# Altium project MCU099_LP-MSPM0L1306.PrjPcb (part 2 of 3)

## Sheet MCU099_02_XDS110_Debug_Probe.SchDoc: XDS110-ET Debug Probe
size 431 x 279 mm; Date: Not shown in title block; ApprovedBy: Not shown in title block; CheckedBy: Not shown in title block; Author: Not shown in title block; CompanyName: Not shown in title block; DrawnBy: Johnson He; Engineer: Not shown in title block; Organization: Not shown in title block; Address1: Not shown in title block; Address2: Not shown in title block; Address3: Not shown in title block; Address4: Not shown in title block; DocumentNumber: 1; Revision: Use project parameter SCH_Rev; SheetNumber: 2; SheetTotal: 6; PageSetup: Record=PageOptions|CenterHorizontal=True|CenterVertical=True|PrintScale=1.00|XCorrection=1.00|YCorrection=1.00|PrintKind=0|BorderSize=5000000|LeftOffset=0|BottomOffset=0|Orientation=2|PaperLength=1000|PaperWidth=1000|Scale=100|PaperSource=15|PrintQuality=600|MediaType=1|DitherType=10|PaperKind=Letter|PrintScaleMode=1; CurrentTime: Not shown in title block; CurrentDate: Not shown in title block; Time: Not shown in title block; DocumentFullPathAndName: Not shown in title block; DocumentName: Not shown in title block; ModifiedDate: Not shown in title block; ImagePath: Not shown in title block
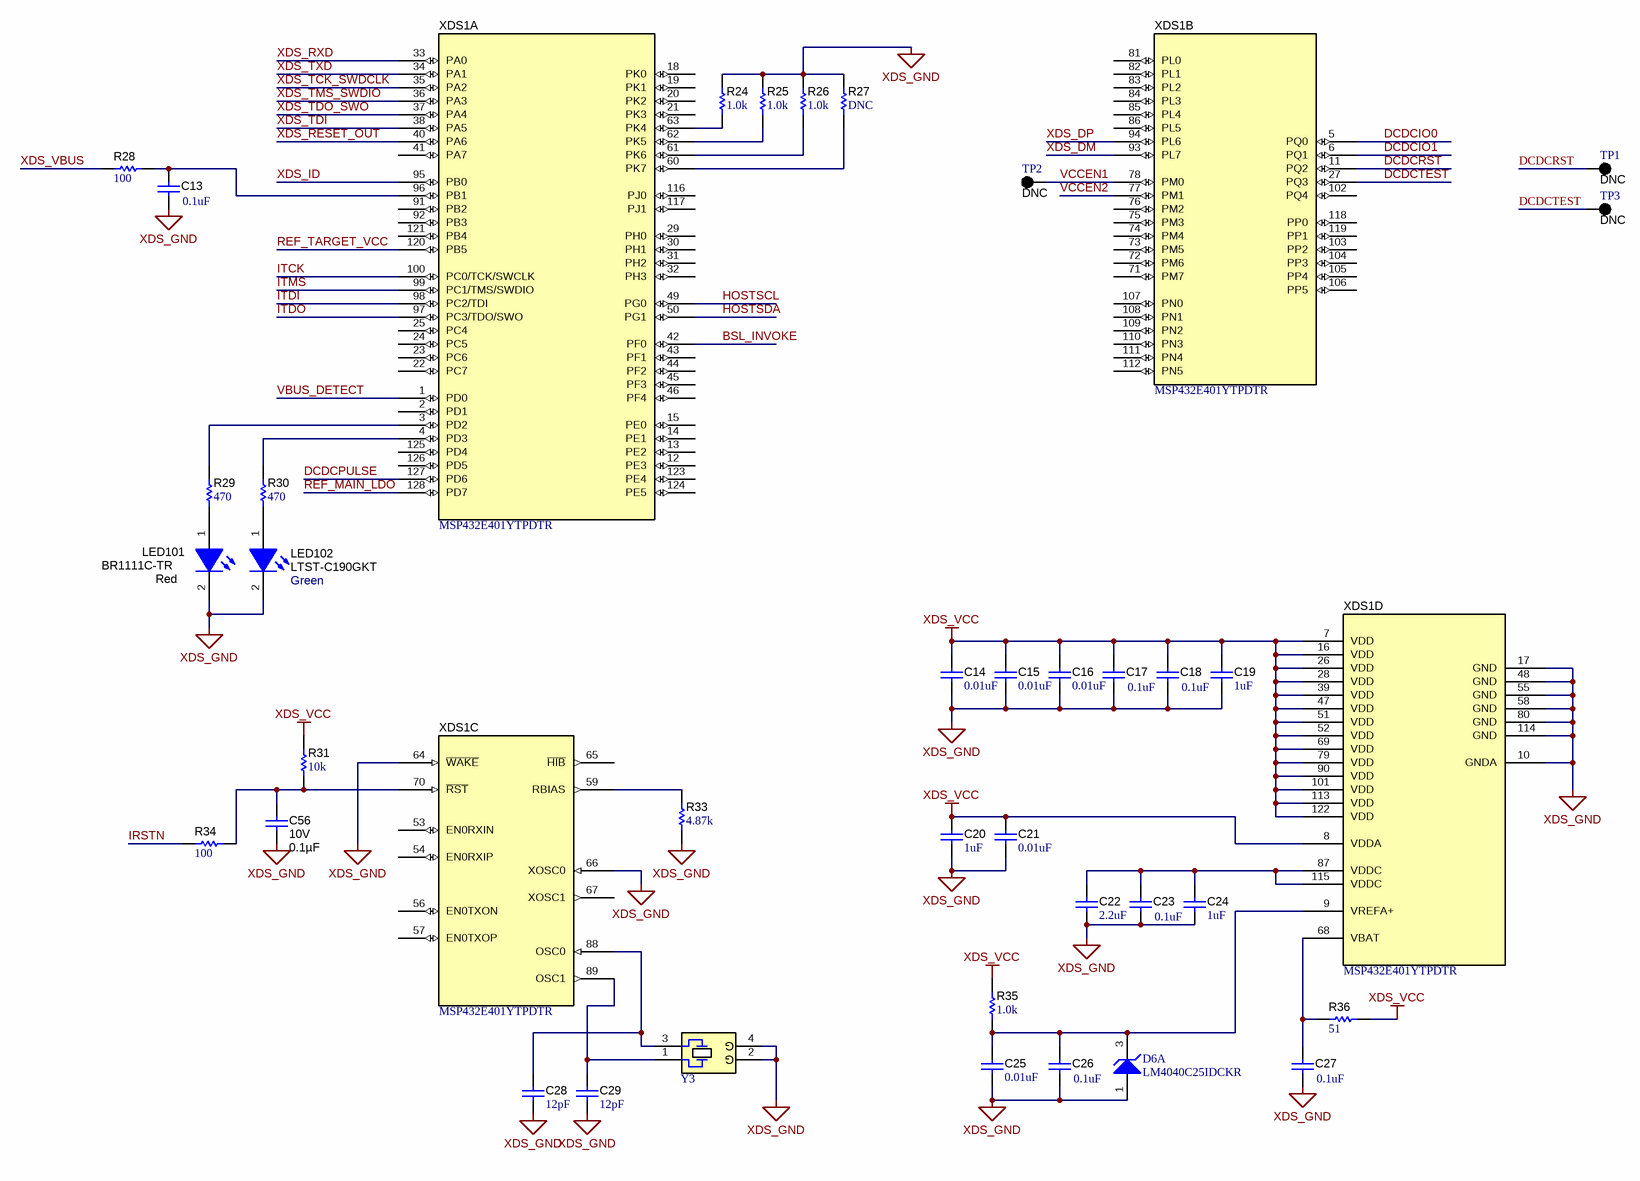
[diagram p1: MCU099_02_XDS110_Debug_Probe.SchDoc]

### Parts
C13  ValueDisplayed: 0.1uF  [0402]  (hidden comment: C1005X5R1A104K050BA)
C14  ValueDisplayed: 0.01uF  [0402]  (hidden comment: GRM155R71E103KA01D)
C15  ValueDisplayed: 0.01uF  [0402]  (hidden comment: GRM155R71E103KA01D)
C16  ValueDisplayed: 0.01uF  [0402]  (hidden comment: GRM155R71E103KA01D)
C17  ValueDisplayed: 0.1uF  [0402]  (hidden comment: C1005X5R1A104K050BA)
C18  ValueDisplayed: 0.1uF  [0402]  (hidden comment: C1005X5R1A104K050BA)
C19  ValueDisplayed: 1uF  [0402]  (hidden comment: C1005X5R1E105K050BC)
C20  ValueDisplayed: 1uF  [0402]  (hidden comment: C1005X5R1E105K050BC)
C21  ValueDisplayed: 0.01uF  [0402]  (hidden comment: GRM155R71E103KA01D)
C22  ValueDisplayed: 2.2uF  [0402]  (hidden comment: GRM155R60J225KE95D)
C23  ValueDisplayed: 0.1uF  [0402]  (hidden comment: C1005X5R1A104K050BA)
C24  ValueDisplayed: 1uF  [0402]  (hidden comment: C1005X5R1E105K050BC)
C25  ValueDisplayed: 0.01uF  [0402]  (hidden comment: GRM155R71E103KA01D)
C26  ValueDisplayed: 0.1uF  [0402]  (hidden comment: C1005X5R1A104K050BA)
C27  ValueDisplayed: 0.1uF  [0402]  (hidden comment: C1005X5R1A104K050BA)
C28  ValueDisplayed: 12pF  [0402]  (hidden comment: GRM1555C1H120JA01D)
C29  ValueDisplayed: 12pF  [0402]  (hidden comment: GRM1555C1H120JA01D)
C56  VDC_V: 10V  ValueDisplayed: 0.1µF  [0402]  (hidden comment: C0402C104K8RACTU)
D6  PartNumber: LM4040C25IDCKR  [DCK0005A_N]  (hidden comment: LM4040B25IDCKR)  (part A of 2)
LED101  BR1111C-TR  value Red  [1111C_Red]
LED102  LTST-C190GKT  value Green  [LED_LTST-C190]
R24  ValueDisplayed: 1.0k  [0402]  (hidden comment: CRCW04021K00JNED)
R25  ValueDisplayed: 1.0k  [0402]  (hidden comment: CRCW04021K00JNED)
R26  ValueDisplayed: 1.0k  [0402]  (hidden comment: CRCW04021K00JNED)
R27  ValueDisplayed: DNC  [0402]  (hidden comment: CRCW04021K00JNED)  (no BOM)
R28  ValueDisplayed: 100  [0402]  (hidden comment: CRCW0402100RJNED)
R29  ValueDisplayed: 470  [0402]  (hidden comment: CRCW0402470RJNED)
R30  ValueDisplayed: 470  [0402]  (hidden comment: CRCW0402470RJNED)
R31  ValueDisplayed: 10k  [0402]  (hidden comment: CRCW040210K0JNED)
R33  ValueDisplayed: 4.87k  [0402]  (hidden comment: CRCW04024K87FKED)
R34  ValueDisplayed: 100  [0402]  (hidden comment: CRCW0402100RJNED)
R35  ValueDisplayed: 1.0k  [0402]  (hidden comment: CRCW04021K00JNED)
R36  ValueDisplayed: 51  [0402]  (hidden comment: CRCW040251R0JNED)
TP1  DNC  [Keystone5001]  (no BOM)
TP2  DNC  [Keystone5001]  (no BOM)
TP3  DNC  [Keystone5001]  (no BOM)
XDS1  MSP432E401YTPDTR  [PDT0128A]  (parts A,B,C,D of 4)
Y3  NX3225GA-16.000M-STD-CRG-1  [NDK_NX3225GA]  (value not drawn)

### Nets
XDS_GND: C13.2 C14.2 C15.2 C16.2 C17.2 C18.2 C19.2 C20.2 C21.2 C22.2 C23.2 C24.2 C25.2 C26.2 C27.2 C28.2 C29.2 C56.2 D6.1(ANODE) LED101.2(K) LED102.2(K) R24.2 R25.2 R26.2 R27.2 R33.1 XDS1.10(GNDA) XDS1.17(GND) XDS1.48(GND) XDS1.55(GND) XDS1.58(GND) XDS1.64(~{WAKE}) XDS1.66(XOSC0) XDS1.80(GND) XDS1.114(GND) Y3.2(GND) Y3.4(GND)
XDS_VCC: C14.1 C15.1 C16.1 C17.1 C18.1 C19.1 C20.1 C21.1 R31.2 R35.2 R36.2 XDS1.7(VDD) XDS1.8(VDDA) XDS1.16(VDD) XDS1.26(VDD) XDS1.28(VDD) XDS1.39(VDD) XDS1.47(VDD) XDS1.51(VDD) XDS1.52(VDD) XDS1.69(VDD) XDS1.79(VDD) XDS1.90(VDD) XDS1.101(VDD) XDS1.113(VDD) XDS1.122(VDD)
BSL_INVOKE: XDS1.42(PF0)
DCDCIO0: XDS1.5(PQ0)
DCDCIO1: XDS1.6(PQ1)
DCDCPULSE: XDS1.127(PD6)
DCDCRST: TP1.1 XDS1.11(PQ2)
DCDCTEST: TP3.1 XDS1.27(PQ3)
HOSTSCL: XDS1.49(PG0)
HOSTSDA: XDS1.50(PG1)
IRSTN: R34.1
ITCK: XDS1.100(PC0/TCK/SWCLK)
ITDI: XDS1.98(PC2/TDI)
ITDO: XDS1.97(PC3/TDO/SWO)
ITMS: XDS1.99(PC1/TMS/SWDIO)
REF_MAIN_LDO: XDS1.128(PD7)
REF_TARGET_VCC: XDS1.120(PB5)
VBUS_DETECT: XDS1.1(PD0)
VCCEN1: TP2.1 XDS1.78(PM0)
VCCEN2: XDS1.77(PM1)
XDS_DM: XDS1.93(PL7)
XDS_DP: XDS1.94(PL6)
XDS_ID: XDS1.95(PB0)
XDS_RESET_OUT: XDS1.40(PA6)
XDS_RXD: XDS1.33(PA0)
XDS_TCK_SWDCLK: XDS1.35(PA2)
XDS_TDI: XDS1.38(PA5)
XDS_TDO_SWO: XDS1.37(PA4)
XDS_TMS_SWDIO: XDS1.36(PA3)
XDS_TXD: XDS1.34(PA1)
XDS_VBUS: R28.1
NetC13_1: C13.1 R28.2 XDS1.96(PB1)
NetC22_1: C22.1 C23.1 C24.1 XDS1.87(VDDC) XDS1.115(VDDC)
NetC25_1: C25.1 C26.1 D6.3(CATHODE) R35.1 XDS1.9(VREFA+)
NetC27_1: C27.1 R36.1 XDS1.68(VBAT)
NetC28_1: C28.1 XDS1.88(OSC0) Y3.3
NetC29_1: C29.1 XDS1.89(OSC1) Y3.1
NetC56_1: C56.1 R31.1 R34.2 XDS1.70(~{RST})
NetLED101_1: LED101.1(A) R29.1
NetLED102_1: LED102.1(A) R30.1
NetR24_1: R24.1 XDS1.63(PK4)
NetR25_1: R25.1 XDS1.62(PK5)
NetR26_1: R26.1 XDS1.61(PK6)
NetR27_1: R27.1 XDS1.60(PK7)
NetR29_2: R29.2 XDS1.3(PD2)
NetR30_2: R30.2 XDS1.4(PD3)
NetR33_2: R33.2 XDS1.59(RBIAS)

Not connected (* = marked no-connect by the designer): XDS1 2(PD1) 12(PE3) 13(PE2) 14(PE1) 15(PE0) 18(PK0) 19(PK1) 20(PK2) 21(PK3) 22(PC7) 23(PC6) 24(PC5) 25(PC4) 29(PH0) 30(PH1) 31(PH2) 32(PH3) 41(PA7) 43(PF1) 44(PF2) 45(PF3) 46(PF4) 53(EN0RXIN) 54(EN0RXIP) 56(EN0TXON) 57(EN0TXOP) 65(~{HIB}) 67(XOSC1) 71(PM7) 72(PM6) 73(PM5) 74(PM4) 75(PM3) 76(PM2) 81(PL0) 82(PL1) 83(PL2) 84(PL3) 85(PL4) 86(PL5) 91(PB2) 92(PB3) 102(PQ4) 103(PP2) 104(PP3) 105(PP4) 106(PP5) 107(PN0) 108(PN1) 109(PN2) 110(PN3) 111(PN4) 112(PN5) 116(PJ0) 117(PJ1) 118(PP0) 119(PP1) 121(PB4) 123(PE4) 124(PE5) 125(PD4) 126(PD5)

### Notes on the sheet
- Drawn By:
- SVN Rev:
- Number:
- TID #:
- Orderable:
- Rev:
- Sheet Title:
- File:
- Project Title:
- Designed for:
- Assembly Variant:
- Mod. Date:
- Sheet:
- Size:
- of
- B
- http://www.ti.com
- Texas Instruments and/or its licensors do not warrant the accuracy or completeness of this specification or any information contained therein. Texas Instruments and/or its licensors do not warrant that this design will meet the specifications, will be suitable for your application or fit for any particular purpose, or will operate in an implementation. Texas Instruments and/or its licensors do not warrant that the design is production worthy. You should completely validate and test your design implementation to confirm the system functionality for your application.
- Engineer:
- Contact:
- © Texas Instruments
- (in symbol CMP-0004635-1) G

### Library data of the parts
C13 C17 C18 C23 C26 C27 = CMP-0006259-2: CAP, CERM, 0.1 uF, 10 V, +/- 10%, X5R, 0402; Manufacturer: TDK; TaMin_C: -55°C; Polarized: N; SizeAreaWB_mm2: 3; Value1: Unknown; U/M: EA; Value: 0.1uF; TaMax_C: 85°C; SizeZ_mm: 0.6; SizeX_mm: 1; SizeY_mm: 0.5; Value2: 10V; Cap_F: 100nF; AEC Category: Q200; Supplier Part Number 2: 90R7585; Publisher: Texas Instruments; Supplier 2: Newark; TempCo: X5R; Published: 2008-06-19; RoHS: Y; MountType: SMT; Supplier 1: Digi-Key; PackageReference: 0402; Tolerance_%: 10%; Cap_Case: 0402; SizeArea_mm2: 0.5; CompType: Capacitor; LatestRevisionDate: 2017-03-09; PartNumber: C1005X5R1A104K050BA; AEC Qualified: ?; VDC_V: 10V; ComponentLink1Description: Datasheet link; Supplier Part Number 1: 445-1265-1-ND; Technology: Ceramic; ComponentLink1URL: http://product.tdk.com/en/catalog/datasheets/mlcc_commercial_general_en.pdf; Supplier 3: Mouser; Supplier Part Number 3: 810-C1005X5R1A104K
C14-C16 C21 C25 = CMP-0006658-2: CAP, CERM, 0.01 uF, 25 V, +/- 10%, X7R, 0402; Manufacturer: MuRata; TaMin_C: -55°C; Polarized: N; SizeAreaWB_mm2: 3; Value1: Unknown; U/M: EA; Value: 0.01uF; TaMax_C: 125°C; SizeZ_mm: 0.6; SizeX_mm: 1; SizeY_mm: 0.5; Value2: 25V; Cap_F: 10nF; AEC Category: Q200; Supplier Part Number 2: 81-GRM36X103K25; Publisher: Texas Instruments; Supplier 2: Mouser; Supplier Part Number 3: 8819734; TempCo: X7R; Supplier 3: Farnell; Published: 2008-06-19; RoHS: Y; MountType: SMT; Supplier 1: Digi-Key; PackageReference: 0402; Tolerance_%: 10%; Cap_Case: 0402; SizeArea_mm2: 0.5; CompType: Capacitor; LatestRevisionDate: 2017-03-09; PartNumber: GRM155R71E103KA01D; AEC Qualified: ?; VDC_V: 25V; ComponentLink1Description: Datasheet link; Supplier Part Number 1: 490-1312-1-ND; Technology: Ceramic; ComponentLink1URL: http://search.murata.co.jp/Ceramy/PnsearchViewAction.do?HnOFG=ON&HnNFG=ON&SEL_CNT=50&sLang=en&sKey=GRM155R71E103KA01D&x=9&y=9&search=startwith
C19 C20 C24 = CMP-0006276-2: CAP, CERM, 1 uF, 25 V, +/- 10%, X5R, 0402; Manufacturer: TDK; TaMin_C: -55°C; Polarized: N; SizeAreaWB_mm2: 3; Value1: Unknown; U/M: EA; Value: 1uF; TaMax_C: 80°C; SizeZ_mm: 0.6; SizeX_mm: 1; SizeY_mm: 0.5; Value2: 25V; Cap_F: 1µF; AEC Category: Q200; ComponentLink1URL: https://product.tdk.com/info/en/catalog/datasheets/mlcc_commercial_general_en.pdf; Supplier Part Number 2: 07W9127; Publisher: Texas Instruments; Supplier 2: Newark; Supplier Part Number 3: 810-C1005X5R1E105K; TempCo: X5R; Supplier 3: Mouser; Published: 2008-06-19; RoHS: Y; MountType: SMT; Supplier 1: Digi-Key; PackageReference: 0402; Tolerance_%: 10%; Cap_Case: 0402; SizeArea_mm2: 0.5; CompType: Capacitor; PartNumber: C1005X5R1E105K050BC; AEC Qualified: N; VDC_V: 25V; ComponentLink1Description: Datasheet link; Supplier Part Number 1: 445-9066-1-ND; LatestRevisionDate: 2017-03-09; Technology: Ceramic; AEC Grade: N/A
C22 = CMP-0006543-2: CAP, CERM, 2.2 uF, 6.3 V, +/- 10%, X5R, 0402; Manufacturer: MuRata; TaMin_C: -55°C; Polarized: N; SizeAreaWB_mm2: 3; Value1: Unknown; U/M: EA; Value: 2.2uF; TaMax_C: 85°C; SizeZ_mm: 0.6; SizeX_mm: 1; SizeY_mm: 0.5; Value2: 6.3V; Cap_F: 2.2µF; AEC Category: Q200; Publisher: Texas Instruments; TempCo: X5R; Published: 2008-06-19; RoHS: Y; MountType: SMT; Supplier 1: Mouser; PackageReference: 0402; Tolerance_%: 10%; Cap_Case: 0402; SizeArea_mm2: 0.5; CompType: Capacitor; LatestRevisionDate: 2017-03-09; PartNumber: GRM155R60J225KE95D; AEC Qualified: N; VDC_V: 6.3V; ComponentLink1Description: Datasheet link; AEC Grade: N/A; Supplier Part Number 1: 81-GRM155R60J225KE5D; Technology: Ceramic; ComponentLink1URL: http://psearch.en.murata.com/capacitor/product/GRM155R60J225KE95%23.pdf
C28 C29 = CMP-0006415-2: CAP, CERM, 12 pF, 50 V, +/- 5%, C0G/NP0, 0402; Manufacturer: MuRata; TaMin_C: -55°C; Polarized: N; SizeAreaWB_mm2: 3; Value1: Unknown; U/M: EA; Value: 12pF; TaMax_C: 125°C; SizeZ_mm: 0.6; SizeX_mm: 1; SizeY_mm: 0.5; Value2: 50V; AEC Category: Q200; Supplier Part Number 2: 81-GRM1555C1H120JA1D; Publisher: Texas Instruments; Supplier 2: Mouser; Supplier Part Number 3: 1828875; TempCo: C0G/NP0; Supplier 3: Farnell; Published: 2008-06-19; RoHS: Y; MountType: SMT; Supplier 1: Newark; PackageReference: 0402; Tolerance_%: 5%; Cap_Case: 0402; SizeArea_mm2: 0.5; CompType: Capacitor; LatestRevisionDate: 2017-03-09; PartNumber: GRM1555C1H120JA01D; AEC Qualified: ?; Cap_F: 12pF; VDC_V: 50V; ComponentLink1Description: Datasheet link; Supplier Part Number 1: 14T3292; Technology: Ceramic; ComponentLink1URL: http://search.murata.co.jp/Ceramy/PnsearchViewAction.do?HnOFG=ON&HnNFG=ON&SEL_CNT=50&sLang=en&sKey=GRM1555C1H120JA01D&x=9&y=9&search=startwith
C56 = CMP-0078241-1: CAP, CERM, 0.1 µF, 10 V,+/- 10%, X7R, 0402; Manufacturer: Kemet; TaMin_C: -55°C; Polarized: N; SizeAreaWB_mm2: 3; U/M: EA; Value: 0.1uF; TaMax_C: 125°C; SizeZ_mm: 0.6; SizeX_mm: 1; SizeY_mm: 0.5; Cap_F: 100nF; AEC Category: Q200; ComponentLink1URL: https://content.kemet.com/datasheets/KEM_C1002_X7R_SMD.pdf; Supplier Part Number 2: 68X2393; Supplier 2: Newark; Supplier Part Number 3: 80-C0402C104K8R; TempCo: X7R; Supplier 3: Mouser; RoHS: Y; MountType: SMT; Supplier 1: Digi-Key; PackageReference: 0402; Tolerance_%: 10%; Cap_Case: 0402; Value2: 10V; SizeArea_mm2: 0.5; CompType: Capacitor; PartNumber: C0402C104K8RACTU; AEC Qualified: N; ComponentLink1Description: Datasheet link; AEC Grade: N/A; Supplier Part Number 1: 399-3520-1-ND; Technology: Ceramic
D6 = CMP-0032785-2: Precision Micropower Shunt Voltage Reference, 0.2% accuracy, 2.5 V, 15 ppm / degC, 15 mA, -40 to 85 degC, 5-pin SC70 (DCK), Green (RoHS & no Sb/Br); Manufacturer: Texas Instruments; Iout/Iz(Max)(mA): 15; Temp Coeff(Max)(ppm/ degree C): 100; VO(V): 2.5; Min Iz for Regulation(uA): 75; Initial Accuracy @ 25/deg C(%): 0.2; Rating: Catalog; AEC Category: Q200; AEC Qualified: N; CompType: IC; SizeAreaWB_mm2: 9.3; SizeArea_mm2: 4.2; SizeX_mm: 2.1; SizeY_mm: 2.0; SizeZ_mm: 1.1; ComponentLink1URL: http://www.ti.com/lit/ds/symlink/lm4040.pdf; PackageReference: DCK0005A; ComponentLink1Description: Datasheet Link; ComponentLink2URL: http://www.ti.com/product/lm4040; ComponentLink2Description: Product Folder; Code_JEDEC: MO-203; DatasheetVersion: SLOS456K; ComponentLink3URL: http://www.ti.com/product/lm4040/datasheet; Eco-Plan: Green (RoHS & no Sb/Br); ComponentLink3Description: Online Datasheet; PackageDescription: SOT-SC70-5; SubFamily: Shunt Voltage Reference; Temp Coeff(Typ)(ppm/ degree C): 15; MountType: SMT; RoHS: Y; PartId: 1
LED101 = CMP-0002972-3: LED, Red, SMD; Manufacturer: Stanley Electric Co., LTD; Power_TotalModule: 57.5mW; Vr_V: 4V; Value1: 0.0575W; Ir_A: 100µA; Io_A: 20mA; Value2: 1.7V; Tjmax_C: 85°C; RoHS: Y; Type: ?; ComponentLink1URL: https://sps06.itg.ti.com/sites/KMS/crossdivteams/altium/docs/ComponentDatasheets/BR1111C-TR.pdf; PackageReference: 1.6x0.8mm; PartNumber: BR1111C-TR; MountType: SMT; ComponentLink1Description: Datasheet link; CompType: LED; Color: Red; Vf_V: 1.7V
LED102 = CMP-0002827-3: LED, Green, SMD; Manufacturer: Lite-On; Power_TotalModule: 100mW; Value2: 2.1V; Io_A: 20mA; Value1: 0.1W; ComponentLink1Description: Datasheet link; PackageReference: 1.6x0.8x0.8mm; CompType: LED; Type: ?; ComponentLink1URL: https://sps06.itg.ti.com/sites/KMS/crossdivteams/altium/docs/ComponentDatasheets/LTST-C190GKT.pdf; Color: green; Vf_V: 2.1V; PartNumber: LTST-C190GKT; RoHS: Y; MountType: SMT
R24-R27 R35 = CMP-0026852-1: RES, 1.0 k, 5%, 0.063 W, 0402; Manufacturer: Vishay-Dale; Power_W: 63mW; TempCo: 200 ppm/C; Value_Code: 1k00; U/M: EA; Value: 1.0k; EIA_Code: E24; Res_ohm: 1k; SizeX_mm: 1; SizeY_mm: 0.5; SizeZ_mm: 0.6; Value2: 0.063W; VDC_V: 50V; AEC Category: Q200; ComponentLink1URL: http://www.vishay.com/docs/20035/dcrcwe3.pdf; Supplier Part Number 2: 59M6691; Publisher: Texas Instruments; Supplier 2: Newark; Supplier Part Number 3: 71-CRCW0402J-1.0K-E3; Supplier 3: Mouser; Published: 2008-06-26; RoHS: Y; Value1: 5%; MountType: SMT; Supplier 1: Digi-Key; PackageReference: 0402; Tolerance_%: 5%; SizeArea_mm2: 0.5; CompType: Resistor; LatestRevisionDate: 2017-03-09; PartNumber: CRCW04021K00JNED; AEC Qualified: ?; ComponentLink1Description: Datasheet link; Supplier Part Number 1: 541-1.0KJCT-ND; Technology: Thick Film
R28 = CMP-0026824-3: RES, 100, 5%, 0.063 W, AEC-Q200 Grade 0, 0402; Manufacturer: Vishay-Dale; Power_W: 63mW; TempCo: 200 ppm/C; Value_Code: 100R; Value: 100; EIA_Code: E24; SizeX_mm: 1; SizeY_mm: 0.5; SizeZ_mm: 0.6; Value2: 0.063W; AEC Qualified: Y; VDC_V: 50V; AEC Category: Q200; AEC Grade: 0; Supplier Part Number 2: 59M6700; Supplier 2: Newark; Supplier Part Number 3: 71-CRCW0402J-100-E3; Supplier 3: Mouser; RoHS: E; Value1: 5%; MountType: SMT; Supplier 1: Digi-Key; PackageReference: 0402; Tolerance_%: 5%; Res_ohm: 100; SizeArea_mm2: 0.5; CompType: Resistor; PartNumber: CRCW0402100RJNED; ComponentLink1Description: Datasheet link; Supplier Part Number 1: 541-100JCT-ND; Technology: Thick Film; ComponentLink1URL: http://www.vishay.com/docs/20035/dcrcwe3.pdf
R29 R30 = CMP-0026934-2: RES, 470, 5%, 0.063 W, 0402; Manufacturer: Vishay-Dale; Power_W: 63mW; TempCo: 200 ppm/C; Value_Code: 470R; U/M: EA; Value: 470; EIA_Code: E24; SizeX_mm: 1; SizeY_mm: 0.5; SizeZ_mm: 0.6; Value2: 0.063W; VDC_V: 50V; AEC Category: Q200; Supplier Part Number 2: 59M6737; Publisher: Texas Instruments; Supplier 2: Newark; Supplier Part Number 3: 71-CRCW0402J-470-E3; Supplier 3: Mouser; Published: 2008-06-26; RoHS: Y; Value1: 5%; MountType: SMT; Supplier 1: Digi-Key; PackageReference: 0402; Tolerance_%: 5%; Res_ohm: 470; SizeArea_mm2: 0.5; CompType: Resistor; LatestRevisionDate: 2017-03-09; PartNumber: CRCW0402470RJNED; AEC Qualified: ?; ComponentLink1Description: Datasheet link; Supplier Part Number 1: 541-470JCT-ND; Technology: Thick Film; ComponentLink1URL: http://www.vishay.com/docs/20035/dcrcwe3.pdf
R31 = CMP-0026825-4: RES, 10 k, 5%, 0.063 W, 0402; Manufacturer: Vishay-Dale; Power_W: 63mW; TempCo: 200 ppm/C; Value_Code: 10k0; U/M: EA; Value: 10k; EIA_Code: E24; SizeX_mm: 1; SizeY_mm: 0.5; SizeZ_mm: 0.6; Value2: 0.063W; VDC_V: 50V; AEC Category: Q200; Supplier Part Number 2: 59M6696; Publisher: Texas Instruments; Supplier 2: Newark; Supplier Part Number 3: 71-CRCW0402J-10K-E3; Supplier 3: Mouser; Published: 2008-06-26; RoHS: Y; Value1: 5%; MountType: SMT; Supplier 1: Digi-Key; PackageReference: 0402; Tolerance_%: 5%; Res_ohm: 10k; SizeArea_mm2: 0.5; CompType: Resistor; LatestRevisionDate: 2017-03-09; PartNumber: CRCW040210K0JNED; AEC Qualified: ?; ComponentLink1Description: Datasheet link; Supplier Part Number 1: 541-10KJCT-ND; Technology: Thick Film; ComponentLink1URL: http://www.vishay.com/docs/20035/dcrcwe3.pdf
R33 = CMP-0026413-2: RES, 4.87 k, 1%, 0.063 W, AEC-Q200 Grade 0, 0402; Manufacturer: Vishay-Dale; Power_W: 63mW; TempCo: 100 ppm/C; Value_Code: 4k87; Value: 4.87k; EIA_Code: E96; SizeX_mm: 1; SizeY_mm: 0.5; SizeZ_mm: 0.6; Value2: 0.063W; AEC Qualified: Y; VDC_V: 50V; AEC Category: Q200; AEC Grade: 0; ComponentLink1URL: http://www.vishay.com/docs/20035/dcrcwe3.pdf; Supplier Part Number 2: 52K7047; Supplier 2: Newark; Supplier Part Number 3: 71-CRCW0402-4.87K-E3; Supplier 3: Mouser; RoHS: E; Value1: 1%; MountType: SMT; Supplier 1: Digi-Key; PackageReference: 0402; Tolerance_%: 1%; Res_ohm: 4.87k; SizeArea_mm2: 0.5; CompType: Resistor; PartNumber: CRCW04024K87FKED; ComponentLink1Description: Datasheet link; Supplier Part Number 1: 541-4.87KLCT-ND; Technology: Thick Film
R34 = CMP-0026824-1: RES, 100, 5%, 0.063 W, 0402; Manufacturer: Vishay-Dale; Power_W: 63mW; TempCo: 200 ppm/C; Value_Code: 100R; U/M: EA; Value: 100; EIA_Code: E24; SizeX_mm: 1; SizeY_mm: 0.5; SizeZ_mm: 0.6; Value2: 0.063W; VDC_V: 50V; AEC Category: Q200; ComponentLink1URL: http://www.vishay.com/docs/20035/dcrcwe3.pdf; Supplier Part Number 2: 59M6700; Publisher: Texas Instruments; Supplier 2: Newark; Supplier Part Number 3: 71-CRCW0402J-100-E3; Supplier 3: Mouser; Published: 2008-06-26; RoHS: Y; Value1: 5%; MountType: SMT; Supplier 1: Digi-Key; PackageReference: 0402; Tolerance_%: 5%; Res_ohm: 100; SizeArea_mm2: 0.5; CompType: Resistor; LatestRevisionDate: 2017-03-09; PartNumber: CRCW0402100RJNED; AEC Qualified: ?; ComponentLink1Description: Datasheet link; Supplier Part Number 1: 541-100JCT-ND; Technology: Thick Film
R36 = CMP-0026946-3: RES, 51, 5%, 0.063 W, AEC-Q200 Grade 0, 0402; Manufacturer: Vishay-Dale; Power_W: 63mW; TempCo: 200 ppm/C; Value_Code: 51R0; Value: 51; EIA_Code: E24; SizeX_mm: 1; SizeY_mm: 0.5; SizeZ_mm: 0.6; Value2: 0.063W; AEC Qualified: Y; VDC_V: 50V; AEC Category: Q200; AEC Grade: 0; Supplier Part Number 2: 72M6804; Supplier 2: Newark; Supplier Part Number 3: 71-CRCW0402J-51-E3; Supplier 3: Mouser; RoHS: E; Value1: 5%; MountType: SMT; Supplier 1: Digi-Key; PackageReference: 0402; Tolerance_%: 5%; Res_ohm: 51; SizeArea_mm2: 0.5; CompType: Resistor; PartNumber: CRCW040251R0JNED; ComponentLink1Description: Datasheet link; Supplier Part Number 1: 541-51JCT-ND; Technology: Thick Film; ComponentLink1URL: http://www.vishay.com/docs/20035/dcrcwe3.pdf
TP1-TP3 = CMP-0055138-1: Test Point, Miniature, Black, TH; Manufacturer: Keystone; CNHeader: FALSE; Green_Lifecycle: Active; Green_REACh: Passed; ContactFinish: Silver; CT: TRUE; ComponentLink1URL: http://www.keyelco.com/userAssets/file/M60-2p60.pdf; Supplier Part Number 2: 534-5001; Publisher: Texas Instruments; Supplier 2: Mouser; Color: Black; RoHS: Y; MountType: TH; Green_EU RoHS-2: Incomplete; Supplier 1: Digi-Key; Green_EU RoHS: Passed; PackageReference: Black Miniature Testpoint; CompType: Test Point; LatestRevisionDate: 26/05/2017; PartNumber: 5001; ComponentLink1Description: Datasheet URL; Supplier Part Number 1: 36-5001-ND
XDS1 = CMP-0077954-1: MSP432E401YTPDT, PDT0128A (TQFP-128); Alternate Manufacturer: Texas Instruments; SizeAreaWB_mm2: 324; SizeZ_mm: 1.2; SizeX_mm: 16; SizeArea_mm2: 256; CompType: IC; AEC Qualified: N; AEC Category: Q200; ComponentLink1URL: http://www.ti.com/lit/ds/symlink/tm4c129encpdt.pdf; Alternate PartNumber: MSP432E401YTPDT; PackageDescription: TQFP-128; MountType: SMT; ComponentLink2URL: TBD; ComponentLink2Description: Product Folder; Manufacturer: Texas Instruments; PackageReference: PDT0128A; SizeY_mm: 16; PartNumber: MSP432E401YTPDTR; ComponentLink1Description: Datasheet Link; PartId: 1
Y3 = CMP-0004635-1: Crystal, 16 MHz, 8pF, SMD; Manufacturer: NDK; TaMax_C: 70°C; TaMin_C: -10°C; Frequency Stability: +/-30ppm; U/M: EA; Frequency_Fixed: 16MHz; ComponentLink1URL: http://www.ndk.com/images/products/catalog/c_NX3225GA-STD-CRG-1_e.pdf; Publisher: Texas Instruments; Supplier 1: Digi-Key; PackageReference: 3.2x0.75x2.5mm; CompType: Crystal; LatestRevisionDate: 18/04/2017; RoHS: Y; Supplier Part Number 1: 644-1157-1-ND; MountType: SMT; PartNumber: NX3225GA-16.000M-STD-CRG-1; ComponentLink1Description: Datasheet Link

## Sheet MCU099_03_XDS110-ET_EnergyTrace.SchDoc: XDS110-ET EnergyTrace
size 431 x 279 mm; Date: Not shown in title block; ApprovedBy: Not shown in title block; CheckedBy: Not shown in title block; Author: Not shown in title block; CompanyName: Not shown in title block; DrawnBy: Johnson He; Engineer: Not shown in title block; Organization: Not shown in title block; Address1: Not shown in title block; Address2: Not shown in title block; Address3: Not shown in title block; Address4: Not shown in title block; DocumentNumber: 2; Revision: Use project parameter SCH_Rev; SheetNumber: 3; SheetTotal: 6; PageSetup: Record=PageOptions|CenterHorizontal=True|CenterVertical=True|PrintScale=1.00|XCorrection=1.00|YCorrection=1.00|PrintKind=0|BorderSize=5000000|LeftOffset=0|BottomOffset=0|Orientation=2|PaperLength=1000|PaperWidth=1000|Scale=100|PaperSource=15|PrintQuality=600|MediaType=1|DitherType=10|PaperKind=Letter|PrintScaleMode=1; CurrentTime: Not shown in title block; CurrentDate: Not shown in title block; Time: Not shown in title block; DocumentFullPathAndName: Not shown in title block; DocumentName: Not shown in title block; ModifiedDate: Not shown in title block; ImagePath: Not shown in title block
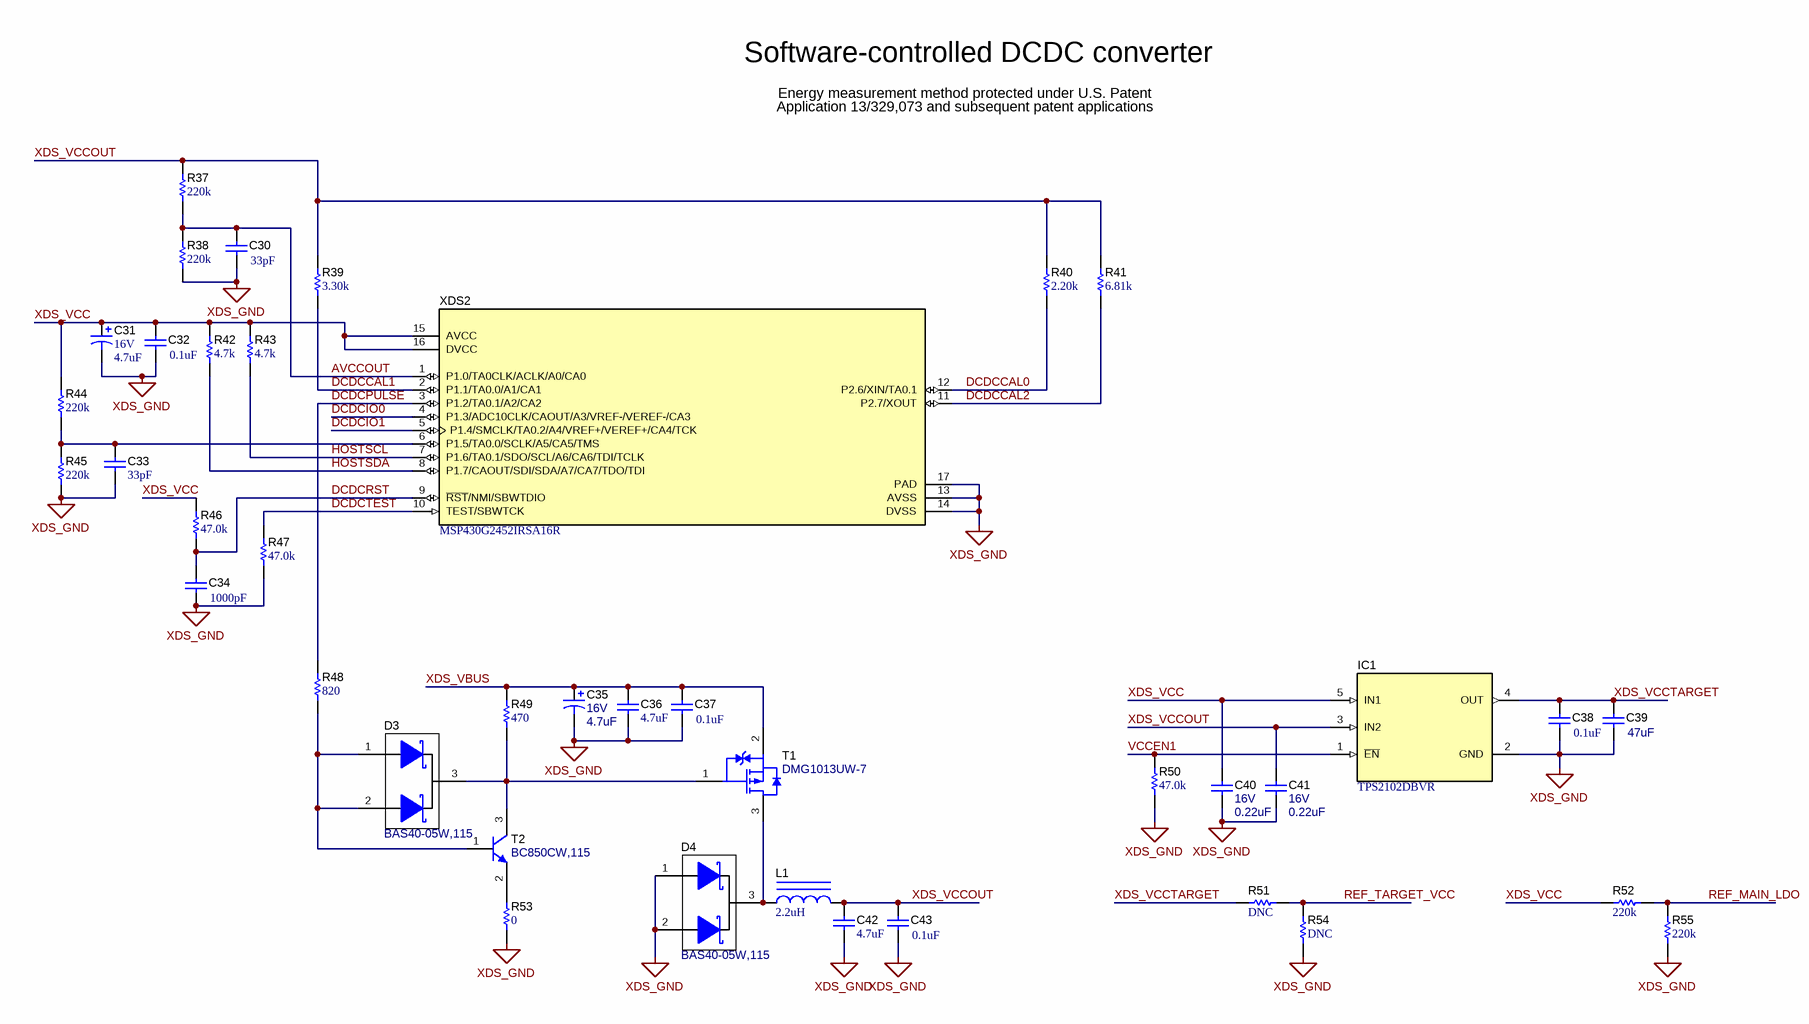
[diagram p2: MCU099_03_XDS110-ET_EnergyTrace.SchDoc]

### Parts
C30  ValueDisplayed: 33pF  [0402]  (hidden comment: GRM1555C1H330JA01D)
C31  VDC_V: 16V  ValueDisplayed: 4.7uF  [3216-18]  (hidden comment: TAJA475K016RNJ)
C32  ValueDisplayed: 0.1uF  [0402]  (hidden comment: C1005X5R1A104K050BA)
C33  ValueDisplayed: 33pF  [0402]  (hidden comment: GRM1555C1H330JA01D)
C34  ValueDisplayed: 1000pF  [0402]  (hidden comment: GRM155R60J102KA01D)
C35  VDC_V: 16V  ValueDisplayed: 4.7uF  [3216-18]  (hidden comment: TAJA475K016RNJ)
C36  ValueDisplayed: 4.7uF  [0603]  (hidden comment: GRM188R61C475KAAJ)
C37  ValueDisplayed: 0.1uF  [0402]  (hidden comment: C1005X5R1A104K050BA)
C38  ValueDisplayed: 0.1uF  [0402]  (hidden comment: C1005X5R1A104K050BA)
C39  ValueDisplayed: 47uF  [0603]  (hidden comment: GRM188R60J476ME15D)
C40  VDC_V: 16V  ValueDisplayed: 0.22uF  [0402]  (hidden comment: GRM155R71C224KA12D)
C41  VDC_V: 16V  ValueDisplayed: 0.22uF  [0402]  (hidden comment: GRM155R71C224KA12D)
C42  ValueDisplayed: 4.7uF  [0603]  (hidden comment: GRM188R61C475KAAJ)
C43  ValueDisplayed: 0.1uF  [0402]  (hidden comment: C1005X5R1A104K050BA)
D3  BAS40-05W,115  [SOT-323]
D4  BAS40-05W,115  [SOT-323]
IC1  TPS2102DBVR  [DBV0005A_N]
L1  ValueDisplayed: 2.2uH  [CBC2518]  (hidden comment: CBC2518T2R2M)
R37  ValueDisplayed: 220k  [0402]  (hidden comment: RC0402FR-07220KL)
R38  ValueDisplayed: 220k  [0402]  (hidden comment: RC0402FR-07220KL)
R39  ValueDisplayed: 3.30k  [0402]  (hidden comment: ERJ-2RKF3301X)
R40  ValueDisplayed: 2.20k  [0402]  (hidden comment: CRCW04022K20FKED)
R41  ValueDisplayed: 6.81k  [0402]  (hidden comment: CRCW04026K81FKED)
R42  ValueDisplayed: 4.7k  [0402]  (hidden comment: CRCW04024K70JNED)
R43  ValueDisplayed: 4.7k  [0402]  (hidden comment: CRCW04024K70JNED)
R44  ValueDisplayed: 220k  [0402]  (hidden comment: RC0402FR-07220KL)
R45  ValueDisplayed: 220k  [0402]  (hidden comment: RC0402FR-07220KL)
R46  ValueDisplayed: 47.0k  [0402]  (hidden comment: RC0402FR-0747KL)
R47  ValueDisplayed: 47.0k  [0402]  (hidden comment: RC0402FR-0747KL)
R48  ValueDisplayed: 820  [0402]  (hidden comment: RC0402FR-07820RL)
R49  ValueDisplayed: 470  [0402]  (hidden comment: CRCW0402470RJNED)
R50  ValueDisplayed: 47.0k  [0402]  (hidden comment: RC0402FR-0747KL)
R51  ValueDisplayed: DNC  [0402]  (hidden comment: CRCW04024K70JNED)  (no BOM)
R52  ValueDisplayed: 220k  [0402]  (hidden comment: CRCW0402220KJNED)
R53  ValueDisplayed: 0  [0603]  (hidden comment: RC0603JR-070RL)
R54  ValueDisplayed: DNC  [0402]  (hidden comment: CRCW04024K70JNED)  (no BOM)
R55  ValueDisplayed: 220k  [0402]  (hidden comment: CRCW0402220KJNED)
T1  DMG1013UW-7  [SOT-323]
T2  BC850CW,115  [SOT-323]
XDS2  MSP430G2452IRSA16R  [RSA0016B]

### Nets
XDS_GND: C30.2 C31.2(-) C32.2 C33.2 C34.2 C35.2(-) C36.1 C37.2 C38.2 C39.2 C40.2 C41.2 C42.1 C43.2 D4.1(A) D4.2(A) IC1.2(GND) R38.1 R45.1 R47.1 R50.1 R53.1 R54.1 R55.1 XDS2.13(AVSS) XDS2.14(DVSS) XDS2.17(PAD)
XDS_VCC: C31.1(+) C32.1 C40.1 IC1.5(IN1) R42.2 R43.2 R44.2 R46.2 R52.2 XDS2.15(AVCC) XDS2.16(DVCC)
AVCCOUT: C30.1 R37.1 R38.2 XDS2.1(P1.0/TA0CLK/ACLK/A0/CA0)
DCDCCAL0: R40.1 XDS2.12(P2.6/XIN/TA0.1)
DCDCCAL1: R39.1 XDS2.2(P1.1/TA0.0/A1/CA1)
DCDCCAL2: R41.1 XDS2.11(P2.7/XOUT)
DCDCIO0: XDS2.4(P1.3/ADC10CLK/CAOUT/A3/VREF-/VEREF-/CA3)
DCDCIO1: XDS2.5(P1.4/SMCLK/TA0.2/A4/VREF+/VEREF+/CA4/TCK)
DCDCPULSE: R48.2 XDS2.3(P1.2/TA0.1/A2/CA2)
DCDCRST: C34.1 R46.1 XDS2.9(~{RST}/NMI/SBWTDIO)
DCDCTEST: R47.2 XDS2.10(TEST/SBWTCK)
HOSTSCL: R43.1 XDS2.7(P1.6/TA0.1/SDO/SCL/A6/CA6/TDI/TCLK)
HOSTSDA: R42.1 XDS2.8(P1.7/CAOUT/SDI/SDA/A7/CA7/TDO/TDI)
REF_MAIN_LDO: R52.1 R55.2
REF_TARGET_VCC: R51.1 R54.2
VCCEN1: IC1.1(~{EN}) R50.2
XDS_VBUS: C35.1(+) C36.2 C37.1 R49.2 T1.2(S)
XDS_VCCOUT: C41.1 C42.2 C43.1 IC1.3(IN2) L1.2 R37.2 R39.2 R40.2 R41.2
XDS_VCCTARGET: C38.1 C39.1 IC1.4(OUT) R51.2
NetC33_1: C33.1 R44.1 R45.2 XDS2.6(P1.5/TA0.0/SCLK/A5/CA5/TMS)
NetD3_1: D3.1(A) D3.2(A) R48.1 T2.1(B)
NetD3_3: D3.3(K) R49.1 T1.1(G) T2.3(C)
NetD4_3: D4.3(K) L1.1 T1.3(D)
NetR53_2: R53.2 T2.2(E)

### Notes on the sheet
- Software-controlled DCDC converter
- Energy measurement method protected under U.S. Patent
- Application 13/329,073 and subsequent patent applications
- Drawn By:
- SVN Rev:
- Number:
- TID #:
- Orderable:
- Rev:
- Sheet Title:
- File:
- Project Title:
- Designed for:
- Assembly Variant:
- Mod. Date:
- Sheet:
- Size:
- of
- B
- http://www.ti.com
- Texas Instruments and/or its licensors do not warrant the accuracy or completeness of this specification or any information contained therein. Texas Instruments and/or its licensors do not warrant that this design will meet the specifications, will be suitable for your application or fit for any particular purpose, or will operate in an implementation. Texas Instruments and/or its licensors do not warrant that the design is production worthy. You should completely validate and test your design implementation to confirm the system functionality for your application.
- Engineer:
- Contact:
- © Texas Instruments

### Library data of the parts
C30 C33 = CMP-0006454-1: CAP, CERM, 33 pF, 50 V, +/- 5%, C0G/NP0, 0402; Manufacturer: MuRata; TaMin_C: -55°C; Polarized: N; SizeAreaWB_mm2: 3; Value1: Unknown; U/M: EA; Value: 33pF; TaMax_C: 125°C; SizeZ_mm: 0.6; SizeX_mm: 1; SizeY_mm: 0.5; Value2: 50V; AEC Category: Q200; ComponentLink1URL: http://search.murata.co.jp/Ceramy/PnsearchViewAction.do?HnOFG=ON&HnNFG=ON&SEL_CNT=50&sLang=en&sKey=GRM1555C1H330JA01D&x=9&y=9&search=startwith; Publisher: Texas Instruments; TempCo: C0G/NP0; Published: 2008-06-19; RoHS: Y; MountType: SMT; Supplier 1: Mouser; PackageReference: 0402; Tolerance_%: 5%; Cap_Case: 0402; SizeArea_mm2: 0.5; CompType: Capacitor; LatestRevisionDate: 2017-03-09; PartNumber: GRM1555C1H330JA01D; AEC Qualified: ?; Cap_F: 33pF; VDC_V: 50V; ComponentLink1Description: Datasheet link; Supplier Part Number 1: 81-GRM1555C1H330JA1D; Technology: Ceramic
C31 C35 = CMP-0011480-1: CAP, TA, 4.7 uF, 16 V, +/- 10%, 4 ohm, SMD; Manufacturer: AVX; TaMin_C: -55°C; ESR_ohm: 4; Polarized: Y; SizeAreaWB_mm2: 10.92; Value1: 4 ohm; U/M: EA; Value: 4.7uF; TaMax_C: 125°C; SizeZ_mm: 1.8; SizeX_mm: 3.2; SizeY_mm: 1.6; SizeArea_mm2: 5.12; CompType: Capacitor; AEC Qualified: N; Cap_F: 4.7µF; AEC Category: Q200; ComponentLink1URL: http://www.avx.com/docs/Catalogs/taj.pdf; Supplier Part Number 2: 60R5857; Publisher: Texas Instruments; Supplier 2: Newark; Supplier Part Number 3: 581-TAJA475K016R; Supplier 3: Mouser; RoHS: Y; MountType: SMT; Supplier 1: Digi-Key; LatestRevisionNote: Updated supplier links; PackageReference: 3216-18; Tolerance_%: 10%; Cap_Case: 3216-18; Value2: 16V; LatestRevisionDate: 2017-03-09; PartNumber: TAJA475K016RNJ; Series: TAJ; ComponentLink1Description: Datasheet link; AEC Grade: N/A; Supplier Part Number 1: 478-3868-1-ND; Technology: TA
C32 C37 C38 C43 = CMP-0006259-2: as C13 on sheet MCU099_02_XDS110_Debug_Probe; Supplier Part Number 2: 90R7585; Publisher: Texas Instruments; Supplier 2: Newark; TempCo: X5R; Published: 2008-06-19; RoHS: Y; MountType: SMT; Supplier 1: Digi-Key; PackageReference: 0402; Tolerance_%: 10%; Cap_Case: 0402; SizeArea_mm2: 0.5; CompType: Capacitor; LatestRevisionDate: 2017-03-09; PartNumber: C1005X5R1A104K050BA; AEC Qualified: ?; VDC_V: 10V; ComponentLink1Description: Datasheet link; Supplier Part Number 1: 445-1265-1-ND; Technology: Ceramic; ComponentLink1URL: http://product.tdk.com/en/catalog/datasheets/mlcc_commercial_general_en.pdf; Supplier 3: Mouser; Supplier Part Number 3: 810-C1005X5R1A104K
C34 = CMP-0006529-2: CAP, CERM, 1000 pF, 6.3 V, +/- 10%, X5R, 0402; Manufacturer: MuRata; TaMin_C: -55°C; Polarized: N; SizeAreaWB_mm2: 3; Value1: Unknown; U/M: EA; Value: 1000pF; TaMax_C: 85°C; SizeZ_mm: 0.6; SizeX_mm: 1; SizeY_mm: 0.5; Value2: 6.3V; Cap_F: 1nF; AEC Category: Q200; Supplier Part Number 2: 81-GRM155R60J102KA1D; Publisher: Texas Instruments; Supplier 2: Mouser; TempCo: X5R; Published: 2008-06-19; RoHS: Y; MountType: SMT; Supplier 1: Digi-Key; PackageReference: 0402; Tolerance_%: 10%; Cap_Case: 0402; SizeArea_mm2: 0.5; CompType: Capacitor; LatestRevisionDate: 2017-03-09; PartNumber: GRM155R60J102KA01D; AEC Qualified: ?; VDC_V: 6.3V; ComponentLink1Description: Datasheet link; Supplier Part Number 1: GRM155R60J102KA01D-ND; Technology: Ceramic; ComponentLink1URL: http://search.murata.co.jp/Ceramy/PnsearchViewAction.do?HnOFG=ON&HnNFG=ON&SEL_CNT=50&sLang=en&sKey=GRM155R60J102KA01D&x=9&y=9&search=startwith
C36 C42 = CMP-0007341-4: CAP, CERM, 4.7 uF, 16 V, +/- 10%, X5R, 0603; Manufacturer: MuRata; TaMin_C: -55°C; Polarized: N; SizeAreaWB_mm2: 4.68; Value1: Unknown; U/M: EA; Value: 4.7uF; TaMax_C: 85°C; SizeZ_mm: 1; SizeX_mm: 1.6; SizeY_mm: 0.8; Value2: 16V; SizeArea_mm2: 1.28; Cap_F: 4.7µF; AEC Category: Q200; Supplier Part Number 2: 81-GRM188R61C475KAJD; Publisher: Texas Instruments; Supplier 2: Mouser; TempCo: X5R; Published: 2008-06-19; RoHS: Y; MountType: SMT; Supplier 1: Digi-Key; PackageReference: 0603; Tolerance_%: 10%; Cap_Case: 0603; CompType: Capacitor; LatestRevisionDate: 2017-03-09; PartNumber: GRM188R61C475KAAJ; AEC Qualified: N; VDC_V: 16V; ComponentLink1Description: Datasheet link; AEC Grade: N/A; Supplier Part Number 1: 490-10481-1-ND; Technology: Ceramic; ComponentLink1URL: http://psearch.murata.com/capacitor/product/GRM188R61C475KAAJ%23.pdf
C39 = CMP-0007313-1: CAP, CERM, 47 uF, 6.3 V, +/- 20%, X5R, 0603; Manufacturer: MuRata; TaMin_C: -55°C; Polarized: N; SizeAreaWB_mm2: 4.68; Value1: Unknown; U/M: EA; Value: 47uF; TaMax_C: 85°C; SizeZ_mm: 1; SizeX_mm: 1.6; SizeY_mm: 0.8; Value2: 6.3V; SizeArea_mm2: 1.28; Cap_F: 47µF; AEC Category: Q200; ComponentLink1URL: http://psearch.en.murata.com/capacitor/product/GRM188R60J476ME15%23.pdf; Publisher: Texas Instruments; TempCo: X5R; Published: 2008-06-19; RoHS: Y; MountType: SMT; PackageReference: 0603; Tolerance_%: 20%; Cap_Case: 0603; CompType: Capacitor; LatestRevisionDate: 2017-03-09; PartNumber: GRM188R60J476ME15D; AEC Qualified: ?; VDC_V: 6.3V; ComponentLink1Description: Datasheet link; Technology: Ceramic
C40 C41 = CMP-0006648-1: CAP, CERM, 0.22 uF, 16 V, +/- 10%, X7R, 0402; Manufacturer: MuRata; TaMin_C: -55°C; Polarized: N; SizeAreaWB_mm2: 3; Value1: Unknown; U/M: EA; Value: 0.22uF; TaMax_C: 125°C; SizeZ_mm: 0.6; SizeX_mm: 1; SizeY_mm: 0.5; Cap_F: 220nF; AEC Category: Q200; ComponentLink1URL: http://search.murata.co.jp/Ceramy/PnsearchViewAction.do?HnOFG=ON&HnNFG=ON&SEL_CNT=50&sLang=en&sKey=GRM155R71C224KA12D&x=9&y=9&search=startwith; Supplier Part Number 2: 81-GRM155R71C224KA2D; Publisher: Texas Instruments; Supplier 2: Mouser; TempCo: X7R; Published: 2008-06-19; RoHS: Y; MountType: SMT; Supplier 1: Digi-Key; PackageReference: 0402; Tolerance_%: 10%; Cap_Case: 0402; Value2: 16V; SizeArea_mm2: 0.5; CompType: Capacitor; LatestRevisionDate: 2017-03-09; PartNumber: GRM155R71C224KA12D; AEC Qualified: ?; ComponentLink1Description: Datasheet link; Supplier Part Number 1: 490-5418-1-ND; Technology: Ceramic
D3 D4 = CMP-0028883-1: Diode, Schottky, 40 V, 0.12 A, AEC-Q101, SOT-323; Manufacturer: Nexperia; Io_A: 120mA; Green_Lifecycle: Not Set; SizeAreaWB_mm2: 10.24; Vr_V: 40V; Green_REACh: Incomplete; Value1: 0.12A; TJmax_C: 150°C; U/M: EA; Value: 40V; SizeZ_mm: 1.1; SizeX_mm: 2.2; Vf_V: 1V; SizeArea_mm2: 4.84; AEC Qualified: Y; AEC Category: Q101; ComponentLink1URL: http://www.nexperia.com/documents/data_sheet/BAS40_1PSXXSB4X_SER.pdf; Supplier Part Number 2: 70R1987; Publisher: Texas Instruments; Supplier 2: Newark; Supplier Part Number 3: 771-BAS40-05W115; Supplier 3: Mouser; Published: 2008-06-26; RoHS: Y; MountType: SMT; Green_EU RoHS-2: Incomplete; Supplier 1: Digi-Key; Green_EU RoHS: Incomplete; PackageReference: SOT-323; SizeY_mm: 2.2; Value2: 1V; CompType: Diode; Type: Schottky; LatestRevisionDate: 2017-05-08; PartNumber: BAS40-05W,115; ComponentLink1Description: Datasheet link; Supplier Part Number 1: 568-7982-1-ND
IC1 = CMP-0074212-1: 2.7-4V Dual In/Single Out MOSFET, 0.5A Main/0.1A Aux Input, Act-Low Enable, Comm. Temp., DBV0005A (SOT-23-5); Alternate PartNumber: TPS2102DBVT; Alternate Manufacturer: Texas Instruments; SizeAreaWB_mm2: 14.82; U/M: EA; SizeZ_mm: 1.45; SizeX_mm: 2.8; SizeY_mm: 2.9; SizeArea_mm2: 8.12; CompType: IC; ComponentLink1URL: http://www.ti.com/lit/ds/symlink/tps2102.pdf; Publisher: Texas Instruments; PackageDescription: SOT-23-5; RoHS: Y; Footprint Path 6: C:\AltiumLibraries\Footprints\TI\.PcbLib; MountType: SMT; Manufacturer: Texas Instruments; PackageReference: DBV0005A; LatestRevisionDate: 2017-06-09; PartNumber: TPS2102DBVR; ComponentLink1Description: Datasheet Link
L1 = CMP-0059590-1: Inductor, Wirewound, Ceramic, 2.2 uH, 0.89 A, 0.13 ohm, SMD; Manufacturer: Taiyo Yuden; Isat: 0.89A @ 30% inductance drop; Irms: 1.1A @ 40C rise; Green_Lifecycle: Active; SizeAreaWB_mm2: 9.8; DCR_ohm: 0.13; Green_REACh: Passed; Value: 2.2uH; Imax_A: 890mA; SizeZ_mm: 1.8; SizeX_mm: 2.5; Value2: 0.89A; SizeArea_mm2: 4.5; Ind_H: 2.2µH; AEC Qualified: N; AEC Category: Q200; ComponentLink1URL: http://www.yuden.co.jp/productdata/catalog/en/wound02_e.pdf; Supplier Part Number 2: 18J0834; Publisher: Texas Instruments; Supplier 2: Newark; Supplier Part Number 3: 963-CBC2518T2R2M; Supplier 3: Mouser; Published: 2008-06-26; RoHS: Y; Value1: 0.13 ohm; Material: Ceramic; MountType: SMT; Green_EU RoHS-2: Passed; Supplier 1: Digi-Key; Green_EU RoHS: Passed; PackageReference: 2.5x1.8x1.8mm; SizeY_mm: 1.8; CompType: Inductor; LatestRevisionDate: 2017-06-02; PartNumber: CBC2518T2R2M; ComponentLink1Description: Datasheet link; AEC Grade: N/A; Supplier Part Number 1: 587-1618-1-ND; Technology: Wirewound
R37 R38 R44 R45 = CMP-0026728-1: RES, 220 k, 1%, 0.0625 W, 0402; Manufacturer: Yageo America; Power_W: 62.5mW; TempCo: 100 ppm/C; U/M: EA; Value: 220k; SizeX_mm: 1; SizeY_mm: 0.5; SizeZ_mm: 0.6; AEC Qualified: N; VDC_V: 50V; AEC Category: Q200; ComponentLink1URL: http://www.yageo.com/documents/recent/PYu-RC0402_51_RoHS_L_6_r.pdf; Supplier Part Number 2: 98K7527; Publisher: Texas Instruments; Supplier 2: Newark; Supplier Part Number 3: 603-RC0402FR-07220KL; Supplier 3: Mouser; Published: 2008-06-26; Value_Code: 220k; RoHS: Y; Value1: 1%; MountType: SMT; Supplier 1: Digi-Key; PackageReference: 0402; Tolerance_%: 1%; Res_ohm: 220k; Value2: 0.0625W; SizeArea_mm2: 0.5; CompType: Resistor; LatestRevisionDate: 2017-03-09; PartNumber: RC0402FR-07220KL; ComponentLink1Description: Datasheet link; AEC Grade: N/A; Supplier Part Number 1: 311-220KLRCT-ND; Technology: Thick Film
R39 = CMP-0026695-1: RES, 3.30 k, 1%, 0.1 W, AEC-Q200 Grade 0, 0402; Manufacturer: Panasonic; Power_W: 100mW; TempCo: 100 ppm/C; Value_Code: 3k30; U/M: EA; Value: 3.30k; Res_ohm: 3.3k; SizeX_mm: 1; SizeY_mm: 0.5; SizeZ_mm: 0.6; Value2: 0.1W; AEC Qualified: Y; VDC_V: 50V; AEC Grade: 0; AEC Category: Q200; ComponentLink1URL: http://industrial.panasonic.com/cdbs/www-data/pdf/RDA0000/AOA0000C86.pdf; Supplier Part Number 2: 64R5278; Publisher: Texas Instruments; Supplier 2: Newark; Supplier Part Number 3: 667-ERJ-2RKF3301X; Supplier 3: Mouser; Published: 2008-06-26; RoHS: Y; Value1: 1%; MountType: SMT; Supplier 1: Digi-Key; PackageReference: 0402; Tolerance_%: 1%; SizeArea_mm2: 0.5; CompType: Resistor; LatestRevisionDate: 2017-03-09; PartNumber: ERJ-2RKF3301X; ComponentLink1Description: Datasheet link; Supplier Part Number 1: P3.30KLCT-ND; Technology: Thick Film
R40 = CMP-0026231-1: RES, 2.20 k, 1%, 0.063 W, 0402; Manufacturer: Vishay-Dale; Power_W: 63mW; TempCo: 100 ppm/C; Value_Code: 2k20; U/M: EA; Value: 2.20k; Res_ohm: 2.2k; SizeX_mm: 1; SizeY_mm: 0.5; SizeZ_mm: 0.6; Value2: 0.063W; AEC Category: Q200; ComponentLink1URL: http://www.vishay.com/docs/20035/dcrcwe3.pdf; Supplier Part Number 2: 26W9020; Publisher: Texas Instruments; Supplier 2: Newark; Supplier Part Number 3: 71-CRCW0402-2.2K-E3; Supplier 3: Mouser; Published: 2008-06-26; RoHS: Y; Value1: 1%; MountType: SMT; Supplier 1: Digi-Key; PackageReference: 0402; Tolerance_%: 1%; SizeArea_mm2: 0.5; CompType: Resistor; LatestRevisionDate: 2017-03-09; PartNumber: CRCW04022K20FKED; AEC Qualified: ?; ComponentLink1Description: Datasheet link; Supplier Part Number 1: 541-2.20KLCT-ND; Technology: Thick Film
R41 = CMP-0026517-1: RES, 6.81 k, 1%, 0.063 W, 0402; Manufacturer: Vishay-Dale; Power_W: 63mW; TempCo: 100 ppm/C; Value_Code: 6k81; U/M: EA; Value: 6.81k; EIA_Code: E96; SizeX_mm: 1; SizeY_mm: 0.5; SizeZ_mm: 0.6; Value2: 0.063W; VDC_V: 50V; AEC Category: Q200; ComponentLink1URL: http://www.vishay.com/docs/20035/dcrcwe3.pdf; Supplier Part Number 2: 52K7188; Publisher: Texas Instruments; Supplier 2: Newark; Supplier Part Number 3: 71-CRCW0402-6.81K-E3; Supplier 3: Mouser; Published: 2008-06-26; RoHS: Y; Value1: 1%; MountType: SMT; Supplier 1: Digi-Key; PackageReference: 0402; Tolerance_%: 1%; Res_ohm: 6.81k; SizeArea_mm2: 0.5; CompType: Resistor; LatestRevisionDate: 2017-03-09; PartNumber: CRCW04026K81FKED; AEC Qualified: ?; ComponentLink1Description: Datasheet link; Supplier Part Number 1: 541-6.81KLCT-ND; Technology: Thick Film
R42 R43 R51 R54 = CMP-0026938-1: RES, 4.7 k, 5%, 0.063 W, 0402; Manufacturer: Vishay-Dale; Power_W: 63mW; TempCo: 200 ppm/C; Value_Code: 4k70; U/M: EA; Value: 4.7k; EIA_Code: E24; SizeX_mm: 1; SizeY_mm: 0.5; SizeZ_mm: 0.6; Value2: 0.063W; VDC_V: 50V; AEC Category: Q200; ComponentLink1URL: http://www.vishay.com/docs/20035/dcrcwe3.pdf; Supplier Part Number 2: 59M6733; Publisher: Texas Instruments; Supplier 2: Newark; Supplier Part Number 3: 71-CRCW0402J-4.7K-E3; Supplier 3: Mouser; Published: 2008-06-26; RoHS: Y; Value1: 5%; MountType: SMT; Supplier 1: Digi-Key; PackageReference: 0402; Tolerance_%: 5%; Res_ohm: 4.7k; SizeArea_mm2: 0.5; CompType: Resistor; LatestRevisionDate: 2017-03-09; PartNumber: CRCW04024K70JNED; AEC Qualified: ?; ComponentLink1Description: Datasheet link; Supplier Part Number 1: 541-4.7KJCT-ND; Technology: Thick Film
R46 R47 R50 = CMP-0026737-1: RES, 47.0 k, 1%, 0.0625 W, 0402; Manufacturer: Yageo America; Power_W: 62.5mW; TempCo: 100 ppm/C; Value_Code: 47k0; U/M: EA; Value: 47.0k; Res_ohm: 47k; SizeX_mm: 1; SizeY_mm: 0.5; SizeZ_mm: 0.6; AEC Qualified: N; VDC_V: 50V; AEC Category: Q200; ComponentLink1URL: http://www.yageo.com/documents/recent/PYu-RC0402_51_RoHS_L_6_r.pdf; Supplier Part Number 2: 67R9937; Publisher: Texas Instruments; Supplier 2: Newark; Supplier Part Number 3: 603-RC0402FR-0747KL; Supplier 3: Mouser; Published: 2008-06-26; RoHS: Y; Value1: 1%; MountType: SMT; Supplier 1: Digi-Key; PackageReference: 0402; Tolerance_%: 1%; Value2: 0.0625W; SizeArea_mm2: 0.5; CompType: Resistor; LatestRevisionDate: 2017-03-09; PartNumber: RC0402FR-0747KL; ComponentLink1Description: Datasheet link; AEC Grade: N/A; Supplier Part Number 1: 311-47.0KLRCT-ND; Technology: Thick Film
R48 = CMP-0026743-1: RES, 820, 1%, 0.063 W, 0402; Manufacturer: Yageo America; Power_W: 63mW; TempCo: 100 ppm/C; Value_Code: 820R; U/M: EA; Value: 820; SizeX_mm: 1; SizeY_mm: 0.5; SizeZ_mm: 0.6; Value2: 0.063W; AEC Qualified: N; VDC_V: 50V; AEC Category: Q200; ComponentLink1URL: http://www.yageo.com/documents/recent/PYu-RC_Group_51_RoHS_L_04.pdf; Supplier Part Number 2: 26M6794; Publisher: Texas Instruments; Supplier 2: Newark; Supplier Part Number 3: 603-RC0402FR-07820RL; Supplier 3: Mouser; Published: 2008-06-26; RoHS: Y; Value1: 1%; MountType: SMT; Supplier 1: Digi-Key; PackageReference: 0402; Tolerance_%: 1%; Res_ohm: 820; SizeArea_mm2: 0.5; CompType: Resistor; LatestRevisionDate: 2017-03-09; PartNumber: RC0402FR-07820RL; ComponentLink1Description: Datasheet link; AEC Grade: N/A; Supplier Part Number 1: 311-820LRCT-ND; Technology: Thick Film
R49 = CMP-0026934-1: RES, 470, 5%, 0.063 W, 0402; Manufacturer: Vishay-Dale; Power_W: 63mW; TempCo: 200 ppm/C; Value_Code: 470R; U/M: EA; Value: 470; EIA_Code: E24; SizeX_mm: 1; SizeY_mm: 0.5; SizeZ_mm: 0.6; Value2: 0.063W; VDC_V: 50V; AEC Category: Q200; ComponentLink1URL: http://www.vishay.com/docs/20035/dcrcwe3.pdf; Supplier Part Number 2: 59M6737; Publisher: Texas Instruments; Supplier 2: Newark; Supplier Part Number 3: 71-CRCW0402J-470-E3; Supplier 3: Mouser; Published: 2008-06-26; RoHS: Y; Value1: 5%; MountType: SMT; Supplier 1: Digi-Key; PackageReference: 0402; Tolerance_%: 5%; Res_ohm: 470; SizeArea_mm2: 0.5; CompType: Resistor; LatestRevisionDate: 2017-03-09; PartNumber: CRCW0402470RJNED; AEC Qualified: ?; ComponentLink1Description: Datasheet link; Supplier Part Number 1: 541-470JCT-ND; Technology: Thick Film
R52 R55 = CMP-0026877-2: RES, 220 k, 5%, 0.063 W, AEC-Q200 Grade 0, 0402; Manufacturer: Vishay-Dale; Power_W: 63mW; TempCo: 200 ppm/C; Value: 220k; EIA_Code: E24; SizeX_mm: 1; SizeY_mm: 0.5; SizeZ_mm: 0.6; Value2: 0.063W; AEC Qualified: Y; VDC_V: 50V; AEC Category: Q200; AEC Grade: 0; ComponentLink1URL: http://www.vishay.com/docs/20035/dcrcwe3.pdf; Supplier Part Number 2: 59M6717; Supplier 2: Newark; Supplier Part Number 3: 71-CRCW0402J-220K-E3; Supplier 3: Mouser; Value_Code: 220k; RoHS: E; Value1: 5%; MountType: SMT; Supplier 1: Digi-Key; PackageReference: 0402; Tolerance_%: 5%; Res_ohm: 220k; SizeArea_mm2: 0.5; CompType: Resistor; PartNumber: CRCW0402220KJNED; ComponentLink1Description: Datasheet link; Supplier Part Number 1: 541-220KJCT-ND; Technology: Thick Film
R53 = CMP-0025885-5: RES, 0, 5%, 0.1 W, 0603; Manufacturer: Yageo; Power_W: 100mW; TempCo: 200 ppm/C; Value_Code: 0000; Value: 0; EIA_Code: E24; SizeX_mm: 1.6; SizeZ_mm: 1; Value2: 0.1W; SizeArea_mm2: 1.28; AEC Qualified: N; VDC_V: 75V; AEC Category: Q200; SizeY_mm: 0.8; SizeAreaWB_mm2: 4.68; Supplier Part Number 2: 603-RC0603JR-070RL; Supplier 2: Mouser; Supplier Part Number 3: 9233130; Supplier 3: Farnell; RoHS: Y; Value1: 5%; MountType: SMT; Supplier 1: Digi-Key; PackageReference: 0603; Tolerance_%: 5%; Res_ohm: 0; CompType: Resistor; PartNumber: RC0603JR-070RL; ComponentLink1Description: Datasheet link; Supplier Part Number 1: 311-0.0GRCT-ND; Technology: Thick Film; ComponentLink1URL: http://www.yageo.com/pdf/Pu-RC0603_51_PbFree_L_2.pdf; AEC Grade: N/A
T1 = CMP-0000035-1: MOSFET, P-CH, -20 V, -0.82 A, SOT-323; Alternate Manufacturer: None; Manufacturer: Diodes Inc.; SizeZ_mm: 1.1; ChType: P; Value2: 0.622 nC; Value1: 0.7; VdsMax_V: -20V; SizeX_mm: 2.2; Vgs_V: -6V; Value: -20V; Rdson45_ohm: 0.75; SizeArea_mm2: 4.84; AEC Category: Q101; IdsMax_A: -820mA; SizeAreaWB_mm2: 10.24; U/M: EA; QgTyp_nC: 0.622; Supplier 2: Mouser; Supplier 1: Digi-Key; Supplier Part Number 1: DMG1013UW-7DICT-ND; Supplier Part Number 2: 621-DMG1013UW-7; PartNumber: DMG1013UW-7; ComponentLink1Description: Datasheet link; LatestRevisionDate: 2017-03-09; ComponentLink1URL: http://www.diodes.com/datasheets/ds31861.pdf; SizeY_mm: 2.2; CompType: MOSFET; PackageReference: SOT-323; LatestRevisionNote: Added parts.; Publisher: Texas Instruments; AEC Qualified: ?; Published: 2008-06-19; RoHS: Y; MountType: SMT
T2 = CMP-0000466-1: Transistor, NPN, 45 V, 0.1 A, SOT-323; Manufacturer: NXP Semiconductor; TaMax_C: 150°C; Value2: 800; Value1: 0.1 A; Vcesat1_V: 250mV; SizeX_mm: 2.2; TaMin_C: -65°C; IcRated_A: 100mA; CompType: BJT; SizeZ_mm: 1.1; Value: 45 V; SizeArea_mm2: 4.84; NPN: 1; Vceo_V: 45V; PNP: 0; AEC Category: Q101; SizeAreaWB_mm2: 10.24; U/M: EA; Supplier 2: Newark; Supplier 3: Mouser; Supplier 1: Digi-Key; Supplier Part Number 1: 568-6076-1-ND; Supplier Part Number 2: 75R0746; Supplier Part Number 3: 771-BC850CW-T/R; PartNumber: BC850CW,115; LatestRevisionDate: 2017-03-09; ComponentLink1URL: http://www.nxp.com/documents/data_sheet/BC849W_850W.pdf; SizeY_mm: 2.2; Publisher: Texas Instruments; AEC Qualified: ?; ComponentLink1Description: Datasheet link; HfeMax: 800; Published: 2008-07-31; RoHS: Y; PackageReference: SOT-323; MountType: SMT
XDS2 = CMP-0039611-2: MSP430G2x52, MSP430G2x12 Mixed Signal Microcontroller, RSA0016B (VQFN-16); Manufacturer: Texas Instruments; Alternate PartNumber: MSP430G2452IRSA16T; Eco-Plan: Green (RoHS & no Sb/Br); ADC: 10-bit SAR; SRAM(B): 256; Temp Sensor: Yes; Frequency(MHz): 16; ADC Channels: 8; Timers - 16-bit: 1; AEC Category: Q200; AEC Qualified: N; CompType: IC; Rating: Catalog; SizeAreaWB_mm2: 25; SizeX_mm: 4; DatasheetVersion: SLAS722E; ComponentLink1Description: Datasheet Link; ComponentLink3Description: Online Datasheet; Code_JEDEC: MO-220; ComponentLink2URL: http://www.ti.com/product/msp430g2452; Brown Out Reset: Yes; PackageReference: RSA0016B; PartNumber: MSP430G2452IRSA16R; Watchdog: Yes; Comparators: Yes; Flash(KB): 8; Cap touch I/O: Yes; ComponentLink3URL: http://www.ti.com/product/msp430g2452/datasheet; ComponentLink1URL: http://www.ti.com/lit/ds/symlink/msp430g2452.pdf; PackageDescription: VQFN-16; GPIO: 16; ComponentLink2Description: Product Folder; MountType: SMT; Operating Temperature Range: -40 to 85 C; RoHS: Y; SizeArea_mm2: 16; SizeY_mm: 4; SizeZ_mm: 1